# Altium schematic sheet S7CAS-PLEIADES-CARTE-MERE_P20_Power-Tree.SchDoc
size Tabloid; SheetNumber: 4; SheetTotal: 17; Sheet_Name: Power Tree; Size: 11x17
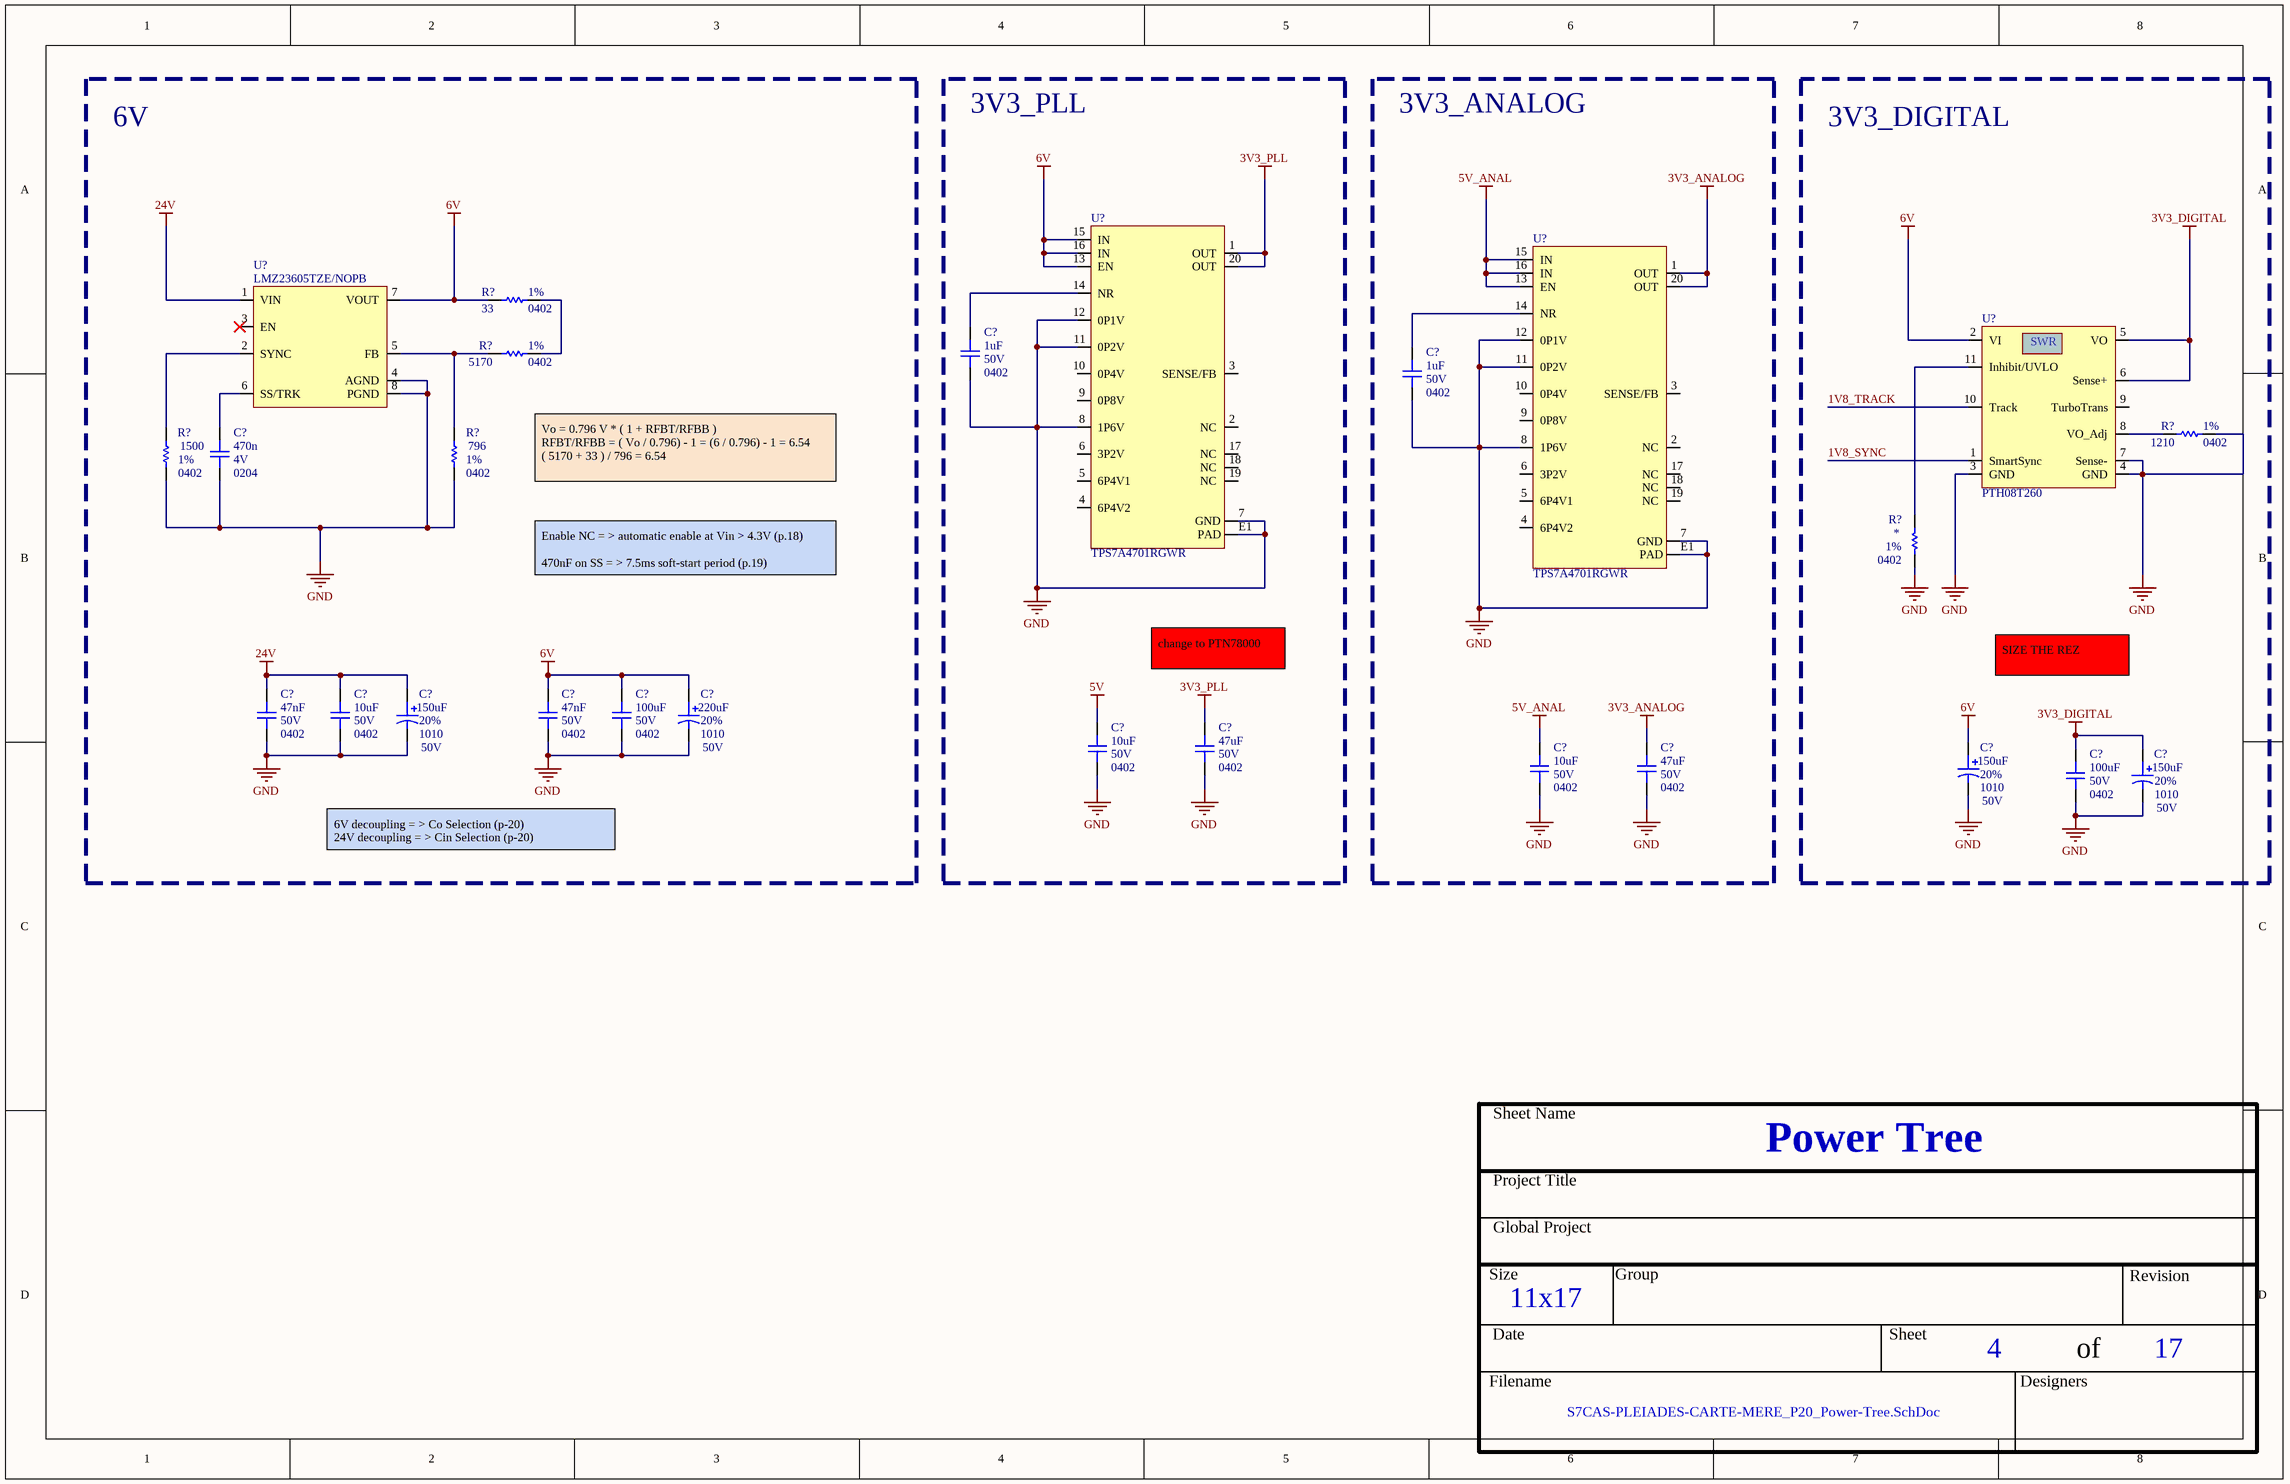
[diagram p0: S7CAS-PLEIADES-CARTE-MERE_P20_Power-Tree.SchDoc]

## Parts
(Parts that share a designator on the sheet are numbered #1, #2 ... from top to bottom, then left to right.)
C?#1  value 1uF  Voltage: 50V  Package: 0402  [CAP_0402]  (hidden comment: CAP - 0402)
C?#2  value 1uF  Voltage: 50V  Package: 0402  [CAP_0402]  (hidden comment: CAP - 0402)
C?#3  value 470n  Voltage: 4V  Package: 0204  [CAP_0402]  (hidden comment: CAP - 0402)
C?#4  value 47nF  Voltage: 50V  Package: 0402  [CAP_0402]  (hidden comment: CAP - 0402)
C?#5  value 10uF  Voltage: 50V  Package: 0402  [CAP_0402]  (hidden comment: CAP - 0402)
C?#6  value 150uF  Voltage: 50V  Package: 1010  Precision: 20%  [CAP_ALU_1010_vishay]  (hidden comment: MAL215099101E3)
C?#7  value 47nF  Voltage: 50V  Package: 0402  [CAP_0402]  (hidden comment: CAP - 0402)
C?#8  value 100uF  Voltage: 50V  Package: 0402  [CAP_0402]  (hidden comment: CAP - 0402)
C?#9  value 220uF  Voltage: 50V  Package: 1010  Precision: 20%  [CAP_ALU_1010_vishay]  (hidden comment: MAL215099101E3)
C?#10  value 10uF  Voltage: 50V  Package: 0402  [CAP_0402]  (hidden comment: CAP - 0402)
C?#11  value 47uF  Voltage: 50V  Package: 0402  [CAP_0402]  (hidden comment: CAP - 0402)
C?#12  value 10uF  Voltage: 50V  Package: 0402  [CAP_0402]  (hidden comment: CAP - 0402)
C?#13  value 47uF  Voltage: 50V  Package: 0402  [CAP_0402]  (hidden comment: CAP - 0402)
C?#14  value 150uF  Voltage: 50V  Package: 1010  Precision: 20%  [CAP_ALU_1010_vishay]  (hidden comment: MAL215099101E3)
C?#15  value 100uF  Voltage: 50V  Package: 0402  [CAP_0402]  (hidden comment: CAP - 0402)
C?#16  value 150uF  Voltage: 50V  Package: 1010  Precision: 20%  [CAP_ALU_1010_vishay]  (hidden comment: MAL215099101E3)
R?#1  value 33  Package: 0402  Precision: 1%  [RES_0402]  (hidden comment: RES - 0402)
R?#2  value 5170  Package: 0402  Precision: 1%  [RES_0402]  (hidden comment: RES - 0402)
R?#3  value 1210  Package: 0402  Precision: 1%  [RES_0402]  (hidden comment: RES - 0402)
R?#4  value 1500  Package: 0402  Precision: 1%  [RES_0402]  (hidden comment: RES - 0402)
R?#5  value 796  Package: 0402  Precision: 1%  [RES_0402]  (hidden comment: RES - 0402)
R?#6  Package: 0402  Precision: 1%  [RES_0402]  (hidden comment: RES - 0402)
U?#1  TPS7A4701RGWR  [REG_TPS7A4701RGWR]
U?#2  TPS7A4701RGWR  [REG_TPS7A4701RGWR]
U?#3  LMZ23605TZE/NOPB  [REG_SWR_LMZ23605TZE/NOPB]
U?#4  PTH08T260  [REG_SWR_PTH08T241WAZ]

## Blocks framed on the sheet
6V: C?#3-C?#9 R?#1 R?#2 R?#4 R?#5 U?#3
3V3_PLL: C?#1 C?#10 C?#11 U?#1
3V3_ANALOG: C?#2 C?#12 C?#13 U?#2
3V3_DIGITAL: C?#14-C?#16 R?#3 R?#6 U?#4

## Nets
3V3_ANALOG: C?#13.2 U?#2.1(OUT) U?#2.20(OUT)
3V3_DIGITAL: C?#15.2 C?#16.1 U?#4.5(VO) U?#4.6(Sense+)
3V3_PLL: C?#11.2 U?#1.1(OUT) U?#1.20(OUT)
5V: C?#10.2
5V_ANAL: C?#12.2 U?#2.13(EN) U?#2.15(IN) U?#2.16(IN)
6V: C?#7.2 C?#8.2 C?#9.1 C?#14.1 R?#1.2 U?#1.13(EN) U?#1.15(IN) U?#1.16(IN) U?#3.7(VOUT) U?#4.2(VI)
24V: C?#4.2 C?#5.2 C?#6.1 U?#3.1(VIN)
GND: C?#1.1 C?#2.1 C?#3.1 C?#4.1 C?#5.1 C?#6.2 C?#7.1 C?#8.1 C?#9.2 C?#10.1 C?#11.1 C?#12.1 C?#13.1 C?#14.2 C?#15.1 C?#16.2 R?#3.1 R?#4.1 R?#5.1 R?#6.1 U?#1.7(GND) U?#1.8(1P6V) U?#1.11(0P2V) U?#1.12(0P1V) U?#1.E1(PAD) U?#2.7(GND) U?#2.8(1P6V) U?#2.11(0P2V) U?#2.12(0P1V) U?#2.E1(PAD) U?#3.4(AGND) U?#3.8(PGND) U?#4.3(GND) U?#4.4(GND) U?#4.7(Sense-)
1V8_SYNC: U?#4.1(SmartSync)
1V8_TRACK: U?#4.10(Track)
NetC?#1_2: C?#1.2 U?#1.14(NR)
NetC?#2_2: C?#2.2 U?#2.14(NR)
NetC?#3_2: C?#3.2 U?#3.6(SS/TRK)
NetR?#1_1: R?#1.1 R?#2.1
NetR?#2_2: R?#2.2 R?#5.2 U?#3.5(FB)
NetR?#3_2: R?#3.2 U?#4.8(VO_Adj)
NetR?#4_2: R?#4.2 U?#3.2(SYNC)
NetR?#6_2: R?#6.2 U?#4.11(Inhibit/UVLO)

Not connected (* = marked no-connect by the designer): U?#1 2(NC) 3(SENSE/FB) 4(6P4V2) 5(6P4V1) 6(3P2V) 9(0P8V) 10(0P4V) 17(NC) 18(NC) 19(NC); U?#2 2(NC) 3(SENSE/FB) 4(6P4V2) 5(6P4V1) 6(3P2V) 9(0P8V) 10(0P4V) 17(NC) 18(NC) 19(NC); U?#3 3(EN)*; U?#4 9(TurboTrans)

## Notes on the sheet
- Vo = 0.796 V * ( 1 + RFBT/RFBB )
  RFBT/RFBB = ( Vo / 0.796) - 1 = (6 / 0.796) - 1 = 6.54
  ( 5170 + 33 ) / 796 = 6.54
- Enable NC = > automatic enable at Vin > 4.3V (p.18)
  470nF on SS = > 7.5ms soft-start period (p.19)
- change to PTN78000
- SIZE THE REZ
- 6V decoupling = > Co Selection (p-20)
  24V decoupling = > Cin Selection (p-20)
- Sheet Name
- Project Title
- Global Project
- Size
- Group
- Revision
- Date
- Sheet
- of
- Filename
- Designers
- (in symbol REG_SWR_PTH08T241WAZ) SWR

## Library data of the parts
C?#1 C?#2 = CAP - 0402: Precision: 10%; Current: *; CreatedBy: Jonathan Bouchard; Power: *
C?#3 = CAP - 0402: Mfg Part Number: GXT155R61C474KE01; Precision: 10%; Current: *; CreatedBy: Jonathan Bouchard; Power: *
C?#4 C?#5 C?#7 C?#8 C?#10-C?#13 C?#15 = CAP - 0402: Mfg Part Number: GRT155R71H272KE01; Precision: 10%; Current: *; CreatedBy: Jonathan Bouchard; Power: *
C?#6 C?#9 C?#14 C?#16 = CAP_ALU_MAL215099101E3: CAP - ALU 100uF 20% 50V - 1010; Current: 490mA; Mfg: Vishay Dale; Mfg Part Number: MAL215099101E3; HelpURL: http://www.vishay.com/docs/28395/150crz.pdf; CreatedBy: Jonathan Bouchard; Temperature: -55°C to 125°C; Power: *; Supplier 1: Digikey; Supplier Part Number 1: 4399PHDKR-ND
R?#1 = RES - 0402: Mfg Part Number: CRCW040233R0FKEDC; Voltage: 50V; Power: 1/16W; Current: *; CreatedBy: Jonathan Bouchard
R?#2 = RES - 0402: Mfg Part Number: RN73H1ETTP5171F50; Voltage: 50V; Power: 1/16W; Current: *; CreatedBy: Jonathan Bouchard
R?#3 R?#4 R?#6 = RES - 0402: Voltage: 50V; Power: 1/16W; Current: *; CreatedBy: Jonathan Bouchard
  R?#6: Value: *
R?#5 = RES - 0402: Mfg Part Number: RN73H1ETTP7960F50; Voltage: 50V; Power: 1/16W; Current: *; CreatedBy: Jonathan Bouchard
U?#1 U?#2 = REG_LDO_TPS7A4701RGWR: REG - LINEAR POS ADJ 1A - 20VQFN; Manufacturer #1: Texas Instruments; GRAMS Lib Spec: 2.8; Magnetic Material: Unknown; Polarized: Yes; Value: 1.4 à 34V; Voltage rating: 35V max; Assembly Type: SMD; CreatedBy/Date: L-P Gauthier / 2018-05-29; Current Rating: 1A; Manufacturer #2: TBD; Part Number #1: TPS7A4701RGWR; Part Number #2: TBD; Package: 20-VQFN Exposed Pad; Power Max: *; Tolerance: -; Supplier 1: Digi-Key; Supplier Part Number 1: 296-37224-1-ND; VerifiedBy: Caroline Paulin - 28 sept 2018; Temperature: -40°C ~ 125°C; HelpURL: http://www.ti.com/lit/ds/symlink/tps7a47.pdf; Cryo: UNKNOWN
U?#3 = REG_SWR_LMZ23605TZE/NOPB: REG - IC BUCK SYNC 36V 5A - TO-PMOD-7; Manufacturer #1: Texas Instruments; Value: 0.8 ~ 6 V; Voltage Rating: 6 ~ 36 V; GRAMS Lib Spec: 2.8; Note: One Reflow; Magnetic Material: YES; Cryo: UNKNOWN; Tolerance: *; Current Rating: 5A; Power Max: *; HelpURL: http://www.ti.com/lit/ds/symlink/lmz23605.pdf; CreatedBy/Date: Arnaud Samson - 05/07/18; VerifiedBy: Jonathan Bouchard 2018-07-13; Temperature: -40°C ~ 125°C; Package: TO-PMOD-7; Manufacturer #2: *; Assembly Type: SMD; Part Number #2: *; Part Number #1: LMZ23605TZE/NOPB; Polarized: YES; Supplier 1: Digi-Key; Supplier Part Number 1: 296-35357-1-ND
U?#4 = REG_SWR_PTH08T241WAZ: REG - MODULE PIP 10A 14VIN - 11-SMD; Manufacturer #1: Texas Instruments; Current Rating: 10A (out); Voltage rating: 4.5-14V (Input), 0.69 - 5.5V (Out); Polarized: Yes; Magnetic Material: UNKNOWN; Manufacturer #2: *; Note: *; Power Max: *; Value: *; Part Number #1: https://www.ti.com/lit/ds/symlink/pth08t261w.pdf?ts=1706597839318&ref_url=https%253A%252F%252Fwww.google.com%252F; Part Number #2: *; HelpURL: http://www.ti.com/lit/ds/symlink/pth08t241w.pdf; Supplier 1: Digi-Key; Supplier Part Number 1: 296-21339-ND; Assembly Type: SMD; Temperature: -40°C ~ 85°C; Package: SMD; CreatedBy/Date: Olivier Bernard / 6/5/2018; VerifiedBy: Caroline Paulin / 10 juillet 2018; Cryo: UNKNOWN